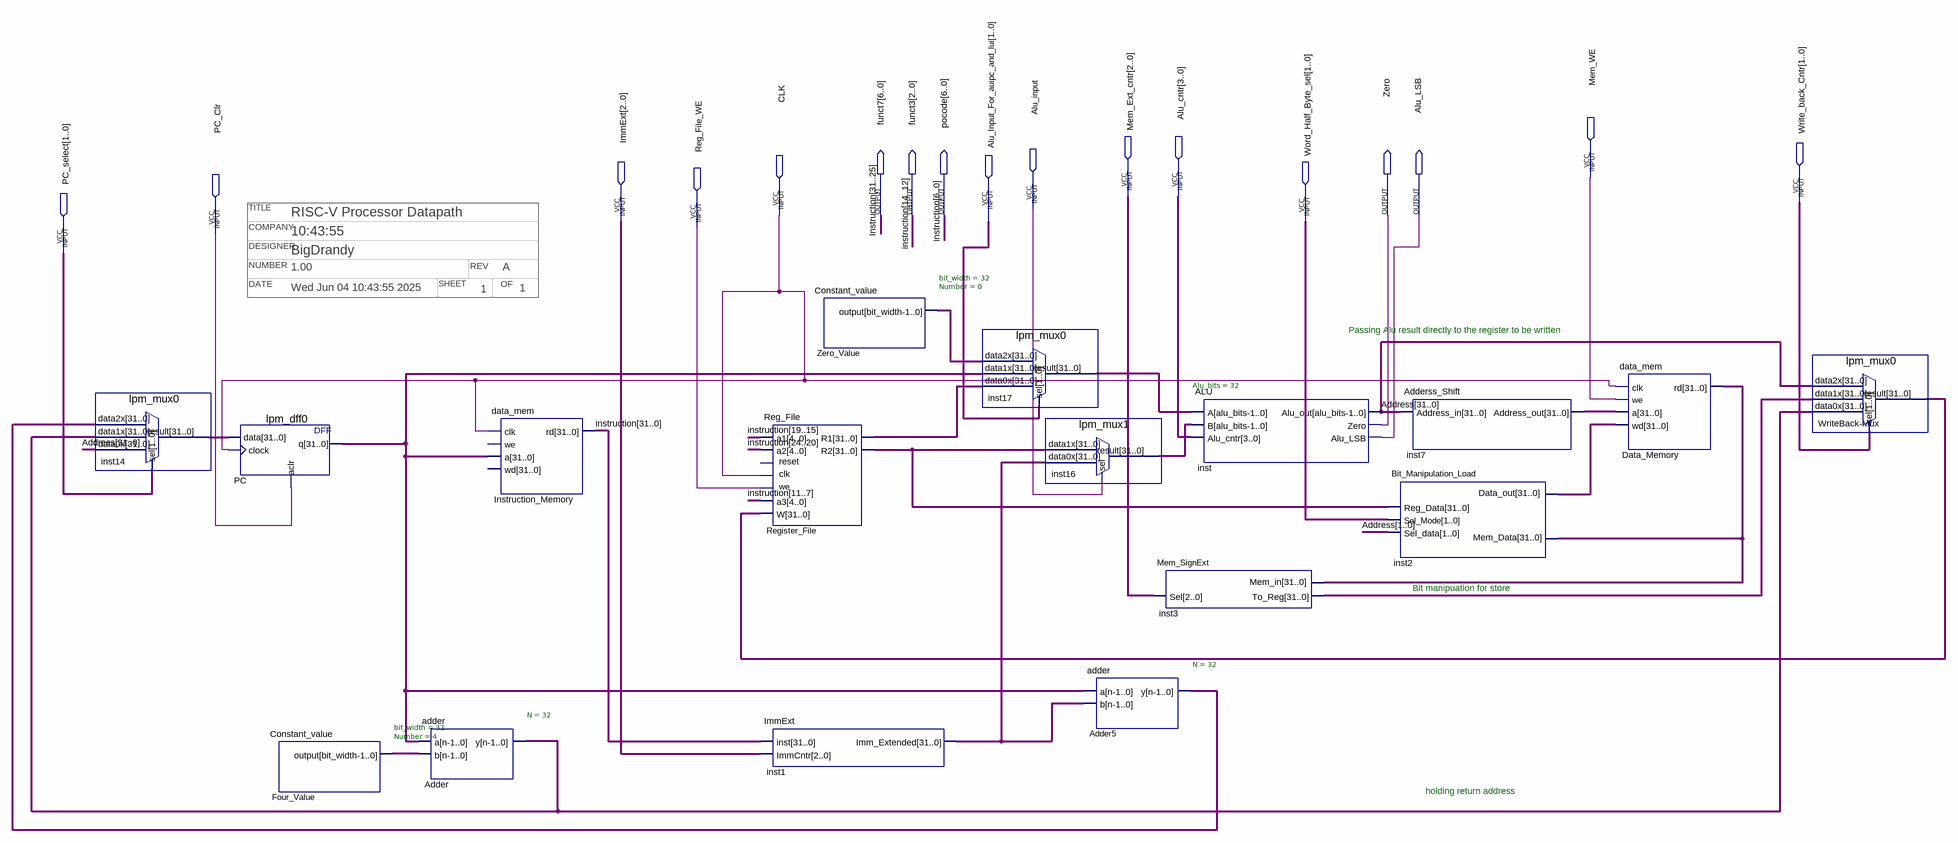
[diagram p0: schematic sheet]
// Quartus schematic Block.bdf as structural Verilog: 17 symbols, 17 pins
// Title block: TITLE: RISC-V Processor Datapath; COMPANY: 10:43:55; DESIGNER: BigDrandy; NUMBER: 1.00; REV: A; DATE: Wed Jun 04 10:43:55 2025; SHEET: 1; OF: 1
module Block (
  input  Mem_WE,
  input  [2:0] Mem_Ext_cntr,
  input  [3:0] Alu_cntr,
  input  [1:0] Write_back_Cntr,
  input  Alu_input,
  input  CLK,
  input  [2:0] ImmExt,
  input  [1:0] Alu_Input_For_auipc_and_lui,
  input  [1:0] Word_Half_Byte_sel,
  input  Reg_File_WE,
  input  PC_Clr,
  input  [1:0] PC_select,
  output [6:0] funct7,
  output [2:0] funct3,
  output [6:0] pocode,
  output Zero,
  output Alu_LSB
);

  wire [24:7] instruction;
  wire [31:0] Adder5_y, Adder_y, Address, Data_Memory_rd, Four_Value_output, inst1_imm_extended,
       inst2_data_out, inst3_to_reg, inst7_address_out, inst14_result, inst16_result, inst17_result, PC_q,
       Register_File_r1, Register_File_r2, WriteBack_Mux_result, Zero_Value_output;

  lpm_mux0 inst14 (.data2x(Adder5_y), .data1x(Adder_y), .data0x(Address), .sel(PC_select), .result(inst14_result));
  lpm_dff0 PC (.data(inst14_result), .clock(CLK), .aclr(PC_Clr), .q(PC_q));
  Constant_value #(.bit_width(32), .Number(4)) Four_Value (.\output (Four_Value_output));
  adder #(.N(32)) Adder (.a(PC_q), .b(Four_Value_output), .y(Adder_y));
  data_mem Instruction_Memory (
    .clk(CLK), .a(PC_q), .rd({funct7, instruction[24:15], funct3, instruction[11:7], pocode}));  // open: we, wd
  Reg_File Register_File (
    .a1(instruction[19:15]), .a2(instruction[24:20]), .a3(instruction[11:7]), .clk(CLK), .we(Reg_File_WE),
    .W(WriteBack_Mux_result), .R1(Register_File_r1), .R2(Register_File_r2));  // open: reset
  ImmExt inst1 (
    .inst({funct7, instruction[24:15], funct3, instruction[11:7], pocode}), .ImmCntr(ImmExt),
    .Imm_Extended(inst1_imm_extended));
  Constant_value #(.bit_width(32), .Number(0)) Zero_Value (.\output (Zero_Value_output));
  lpm_mux0 inst17 (
    .data2x(Zero_Value_output), .data1x(PC_q), .data0x(Register_File_r1), .sel(Alu_Input_For_auipc_and_lui),
    .result(inst17_result));
  lpm_mux1 inst16 (.data1x(Register_File_r2), .data0x(inst1_imm_extended), .sel(Alu_input), .result(inst16_result));
  adder #(.N(32)) Adder5 (.a(PC_q), .b(inst1_imm_extended), .y(Adder5_y));
  ALU #(.Alu_bits(32)) inst (
    .A(inst17_result), .B(inst16_result), .Alu_cntr(Alu_cntr), .Alu_out(Address), .Zero(Zero),
    .Alu_LSB(Alu_LSB));
  Mem_SignExt inst3 (.Mem_in(Data_Memory_rd), .Sel(Mem_Ext_cntr), .To_Reg(inst3_to_reg));
  Bit_Manipulation_Load inst2 (
    .Mem_Data(Data_Memory_rd), .Reg_Data(Register_File_r2), .Sel_Mode(Word_Half_Byte_sel),
    .Sel_data(Address[1:0]), .Data_out(inst2_data_out));
  Adderss_Shift inst7 (.Address_in(Address), .Address_out(inst7_address_out));
  data_mem Data_Memory (.clk(CLK), .we(Mem_WE), .a(inst7_address_out), .wd(inst2_data_out), .rd(Data_Memory_rd));
  lpm_mux0 \WriteBack-Mux  (
    .data2x(Address), .data1x(inst3_to_reg), .data0x(Adder_y), .sel(Write_back_Cntr),
    .result(WriteBack_Mux_result));

  // Other names for the same wires on the sheet: instruction (some bits) = {funct7, funct3, pocode}

  // Notes on the sheet:
  //   Passing Alu result directly to the register to be written
  //   Bit manipuation for store
  //   holding return address
endmodule
